# EasyEDA Pro project ProProject_ads1299+stm32f407第七版_2024-07-30.epro, board PCB
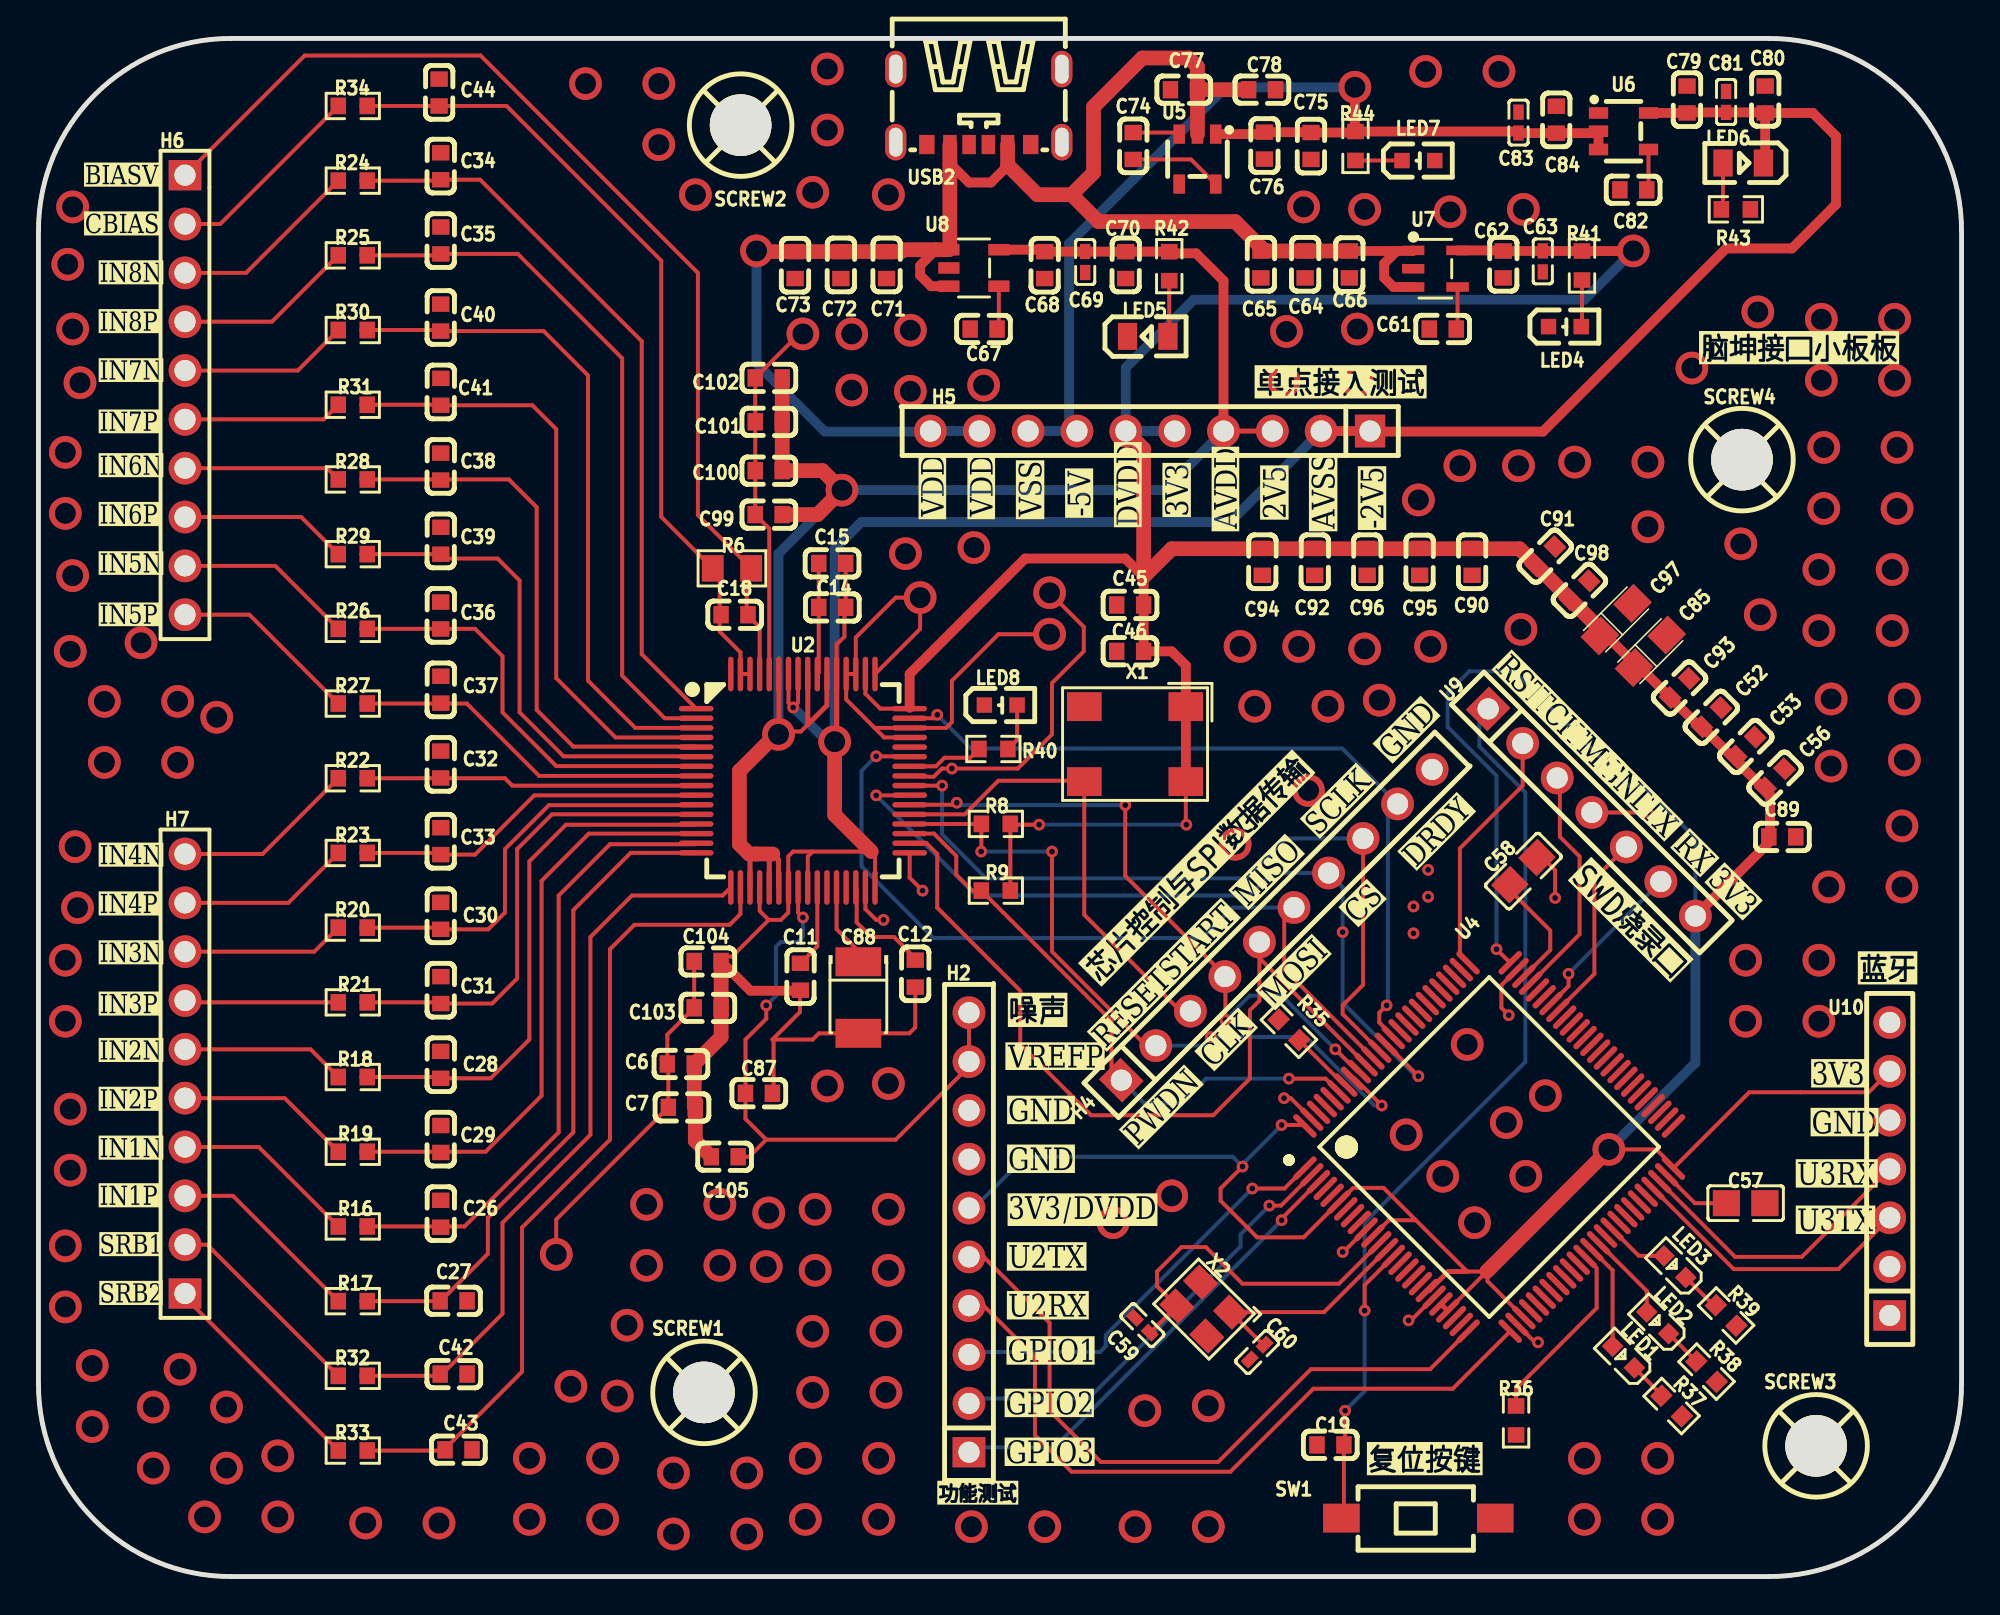
[diagram p3: board, top side]
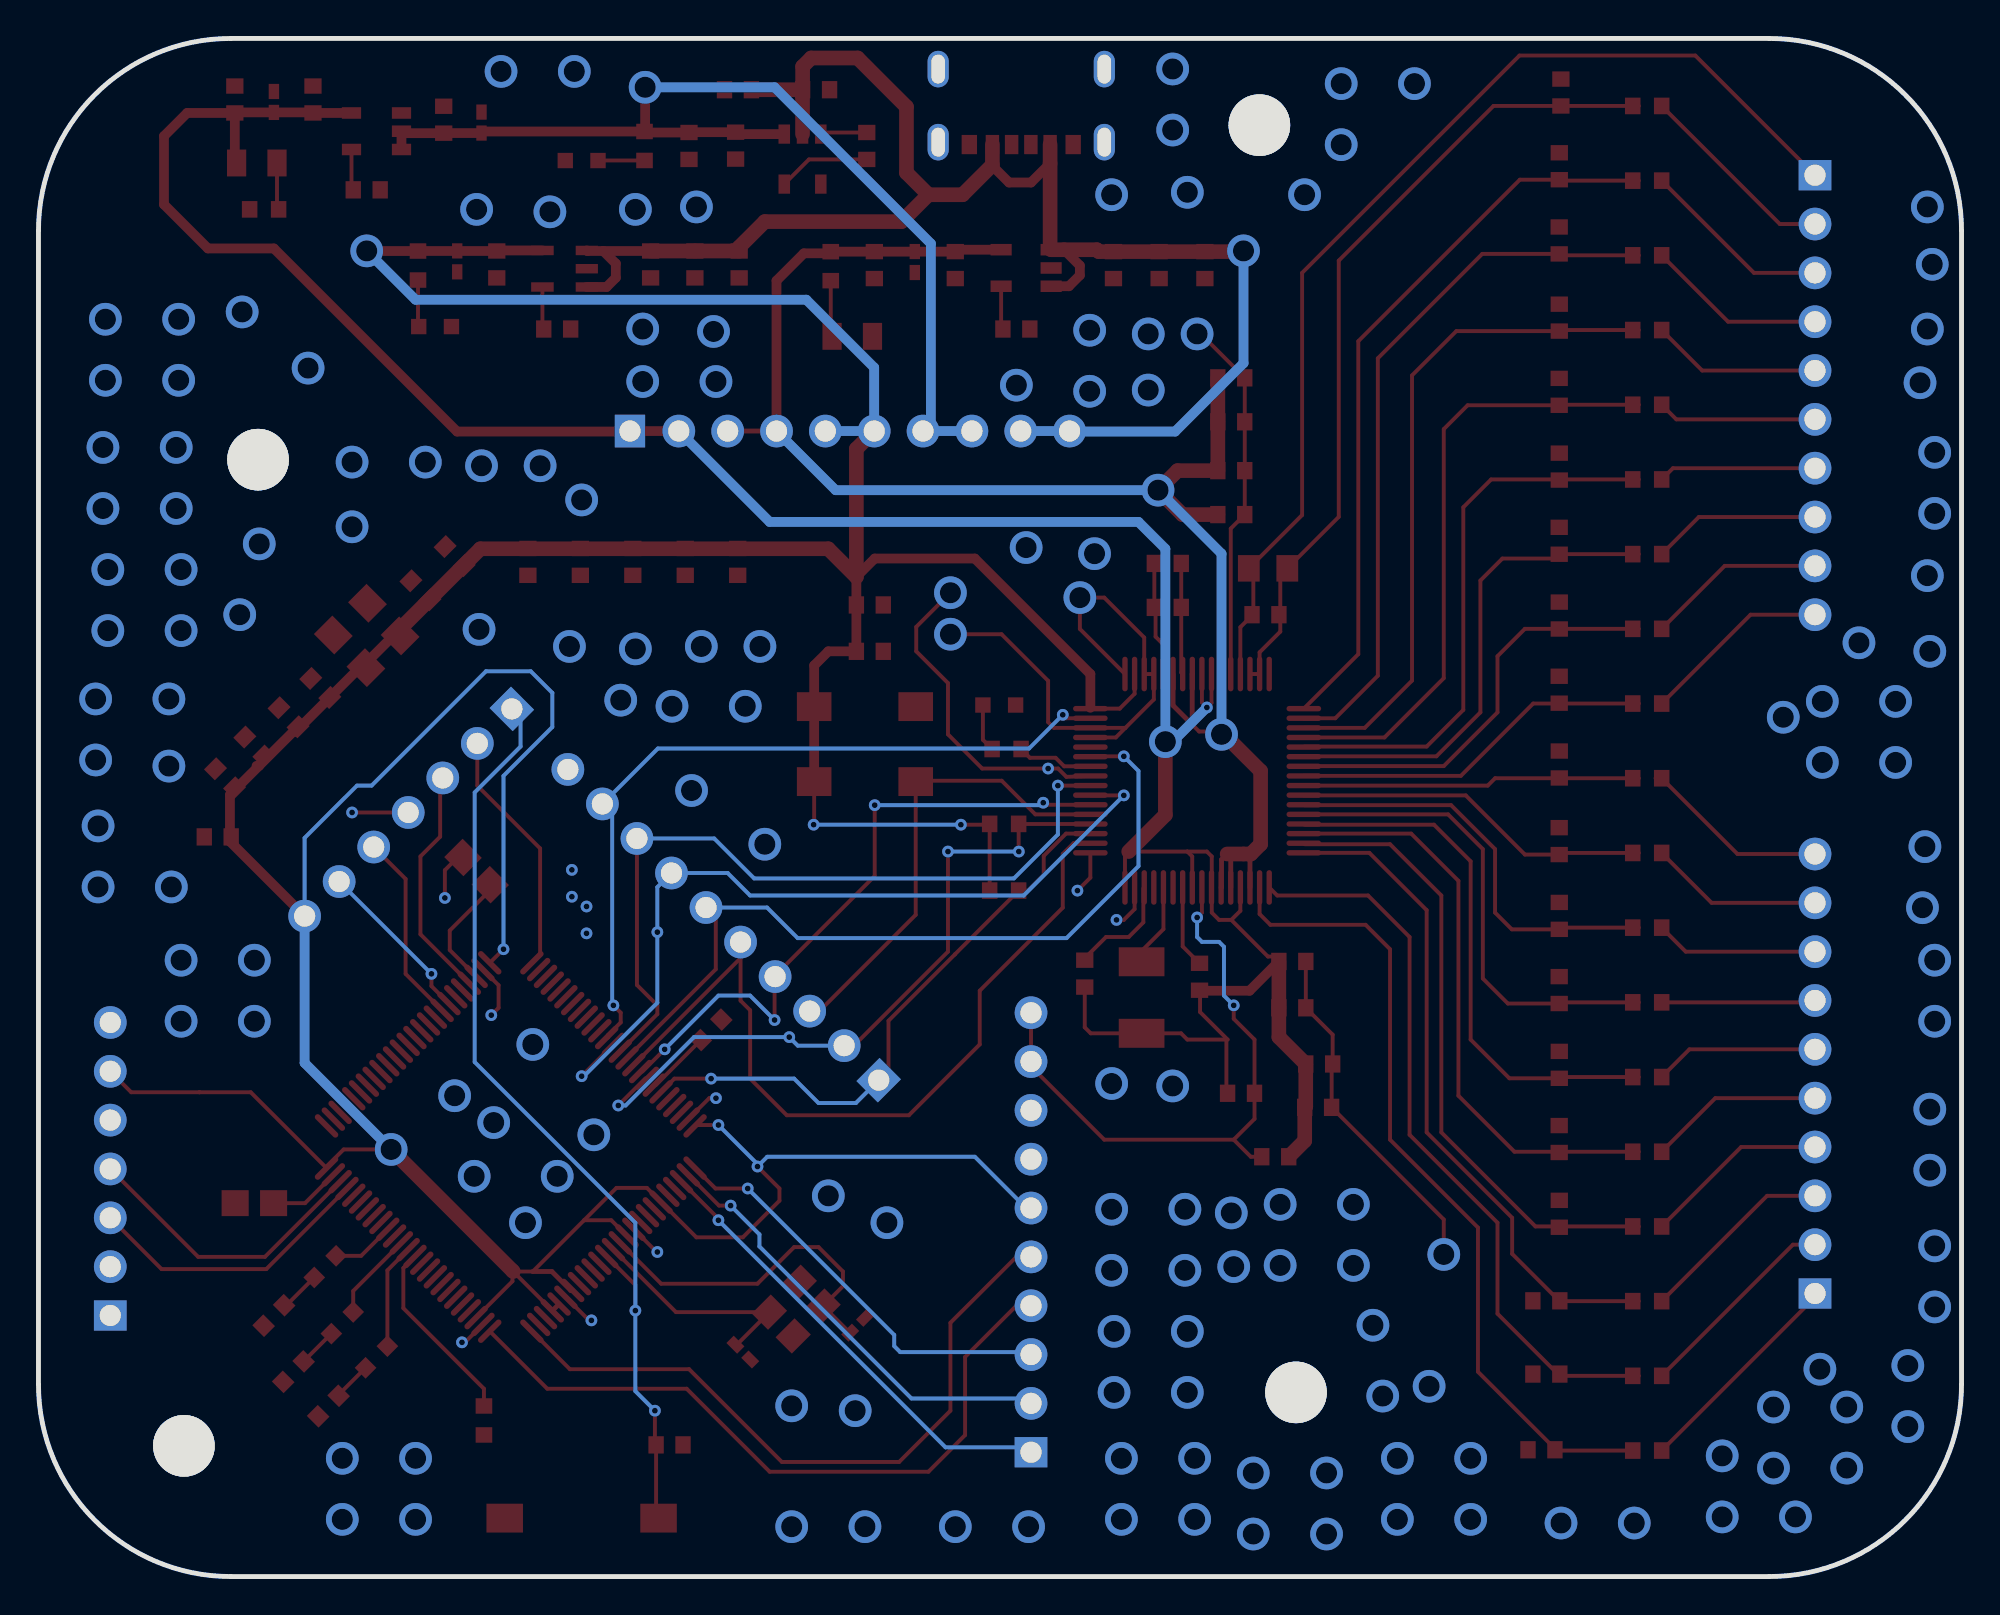
[diagram p4: board, bottom side, seen from below]

Outline 100 x 80 mm; copper layers: Top Layer, Bottom Layer. Coordinates in mm from the lower left corner of the outline.
Outline path: 0,70 0,10 arc(2.93,2.93) 10,0 90,0 arc(97.07,2.93) 100,10 100,70 arc(97.07,77.07) 90,80 10,80 arc(2.93,77.07) 0,70
Stack: Top Layer 0.035mm / Dielectric1 1.51mm FR4 er 4.5 / Bottom Layer 0.035mm

## Design rules (mm)
net GND: POWER
net DVDD: POWER
net VDD: POWER
net AVDD: POWER
net AVSS: POWER
net VSS: POWER
template: 自定义配置
spacing copperThickness1oz (default): track to track 0.102, other pairs 0.152 to 0.3
spacing copperThickness2oz: track to track 0.203, other pairs 0.152 to 0.3
track width copperThickness1oz (default): min 0.203, default 0.203, max 0.203
track width copperThickness2oz: min 0.203, default 0.254, max 2.54
track width power: min 0.203, default 0.254, max 5.08
differential pair differentialPair (default): width min 0.127, default 0.254, max 2.54; gap min 0.152, default 0.152
via viaSize (default): diameter min 0.61, default 0.61, max 10; hole min 0.305, default 0.305, max 6.299
net class POWER uses power
net GND uses power
net DVDD uses power
net VDD uses power
net AVDD uses power
net AVSS uses power
net VSS uses power

## Placement (name value [footprint] x y rotation side)
C6  1uF  [C0603]  33.4 26.66 180 top
C7  1uF  [C0603]  33.46 24.4 180 top
C11  1uF  [C0603]  39.62 31.2 270 top
C12  1uF  [C0603]  45.59 31.36 90 top
C14  100nF  [C0603]  41.28 50.41 180 top
C15  1uF  [C0603]  41.28 52.69 0 top
C18  1.5nF  [C0603]  36.19 50.03 180 top
C19  100nF  [C0603]  67.18 6.85 0 top
C26  4.7nF  [C0603]  20.92 18.87 270 top
C27  4.7nF  [C0603]  21.59 14.34 0 top
C28  4.7nF  [C0603]  20.92 26.61 270 top
C29  4.7nF  [C0603]  20.92 22.76 90 top
C30  4.7nF  [C0603]  20.92 34.36 270 top
C31  4.7nF  [C0603]  20.92 30.5 90 top
C32  4.7nF  [C0603]  20.92 42.24 270 top
C33  4.7nF  [C0603]  20.92 38.25 90 top
C34  4.7nF  [C0603]  20.92 73.35 270 top
C35  4.7nF  [C0603]  20.92 69.49 90 top
C36  4.7nF  [C0603]  20.92 49.98 270 top
C37  4.7nF  [C0603]  20.92 46.13 90 top
C38  4.7nF  [C0603]  20.92 57.73 270 top
C39  4.7nF  [C0603]  20.92 53.87 90 top
C40  4.7nF  [C0603]  20.92 65.48 270 top
C41  4.7nF  [C0603]  20.92 61.62 90 top
C42  4.7nF  [C0603]  21.59 10.53 180 top
C43  4.7nF  [C0603]  21.84 6.59 0 top
C44  4.7nF  [C0603]  20.83 77.19 270 top
C45  1uF  [C0603]  56.77 50.54 0 top
C46  100nF  [C0603]  56.77 48.12 0 top
C52  100nF  [C0603]  87 44.69 45 top
C53  100nF  [C0603]  88.77 43.17 225 top
C56  100nF  [C0603]  90.3 41.52 225 top
C57  2.2uF  [C0805]  88.77 19.42 0 top
C58  2.2uF  [C0805]  77.22 36.69 45 top
C59  9pF  [C0402]  57.4 13.07 315 top
C60  9pF  [C0402]  63.37 11.67 45 top
C61  1uF  [C0603]  73.03 64.89 0 top
C62  10uF  [C0603]  76.17 68.25 270 top
C63  2.2uF  [C0402]  78.22 68.41 90 top
C64  10uF  [C0603]  65.87 68.25 270 top
C65  10uF  [C0603]  63.56 68.25 270 top
C66  1uF  [C0603]  68.17 68.25 90 top
C67  1uF  [C0603]  49.15 64.89 0 top
C68  1uF  [C0603]  52.33 68.21 90 top
C69  2.2uF  [C0402]  54.43 68.37 90 top
C70  10uF  [C0603]  56.53 68.21 270 top
C71  10uF  [C0603]  44.1 68.21 270 top
C72  10uF  [C0603]  41.72 68.21 270 top
C73  1uF  [C0603]  39.35 68.21 90 top
C74  1uF  [C0603]  56.93 74.41 270 top
C75  1uF  [C0603]  66.17 74.41 90 top
C76  10uF  [C0603]  63.75 74.42 270 top
C77  1uF  [C0603]  59.56 77.33 0 top
C78  10uF  [C0603]  63.63 77.33 0 top
C79  10uF  [C0603]  85.72 76.83 90 top
C80  1uF  [C0603]  89.79 76.83 270 top
C81  2.2uF  [C0402]  87.76 76.7 270 top
C82  10nF  [C0603]  82.93 72.13 0 top
C83  2.2uF  [C0402]  76.96 75.62 270 top
C84  10uF  [C0603]  78.93 75.77 90 top
C85  1uF  [CASE-A_3216]  83.82 48.12 45 top
C87  10uF  [C0603]  37.47 25.14 0 top
C88  100uF  [CASE-B_3528]  42.64 30.12 270 top
C89  4.7uF  [C0603]  90.68 38.47 180 top
C90  100nF  [C0603]  74.55 52.78 270 top
C91  100nF  [C0603]  78.36 53.08 45 top
C92  100nF  [C0603]  66.37 52.78 270 top
C93  100nF  [C0603]  85.34 46.22 45 top
C94  100nF  [C0603]  63.64 52.78 270 top
C95  1uF  [C0603]  71.82 52.78 90 top
C96  100nF  [C0603]  69.09 52.78 270 top
C97  1uF  [CASE-A_3216]  82.04 49.77 45 top
C98  100nF  [C0603]  80.14 51.3 45 top
C99  1uF  [C0603]  37.97 55.23 180 top
C100  1uF  [C0603]  37.97 57.52 180 top
C101  100nF  [C0603]  37.97 60.06 180 top
C102  100nF  [C0603]  37.97 62.35 180 top
C103  100nF  [C0603]  34.8 29.58 180 top
C104  100nF  [C0603]  34.8 31.99 180 top
C105  100nF  [C0603]  35.69 21.83 0 top
H2  PM254-1-10-Z-8.5  [HDR-TH_10P-P2.54-V-F]  48.39 17.9 90 top
H4  PM254-1-10-Z-8.5  [HDR-TH_10P-P2.54-V-F]  64.39 33.9 45 top
H5  PM254-1-10-Z-8.5  [HDR-TH_10P-P2.54-V-F]  57.81 59.58 180 top
H6  2.54-1*10P针  [HDR-TH_10P-P2.54-V-M-1]  7.62 61.46 270 top
H7  2.54-1*10P针  [HDR-TH_10P-P2.54-V-M-1]  7.62 26.15 90 top
LED1  KT-0603R  [LED0603-RD]  82.42 11.42 135 top
LED2  KT-0603R  [LED0603-RD]  84.2 13.2 135 top
LED3  KT-0603R  [LED0603-RD]  85.09 16.12 135 top
LED4  KT-0603W  [LED0603-R-RD_WHITE]  79.38 65.01 0 top
LED5  KT-0805G  [LED0805-R-RD]  57.68 64.51 0 top
LED6  KT-0805G  [LED0805-R-RD]  88.65 73.52 180 top
LED7  KT-0603W  [LED0603-R-RD_WHITE]  71.75 73.65 0 top
LED8  KT-0603W  [LED0603-R-RD_WHITE]  50.04 45.33 0 top
R6  1MΩ  [R0805]  36.06 52.44 180 top
R8  10kΩ  [R0603]  49.78 39.15 0 top
R9  10kΩ  [R0603]  49.78 35.68 0 top
R16  11kΩ  [R0603]  16.34 18.21 0 top
R17  11kΩ  [R0603]  16.34 14.32 0 top
R18  11kΩ  [R0603]  16.34 25.98 0 top
R19  11kΩ  [R0603]  16.34 22.09 0 top
R20  11kΩ  [R0603]  16.34 33.75 0 top
R21  11kΩ  [R0603]  16.34 29.87 0 top
R22  11kΩ  [R0603]  16.34 41.52 0 top
R23  11kΩ  [R0603]  16.34 37.64 0 top
R24  11kΩ  [R0603]  16.34 72.6 0 top
R25  11kΩ  [R0603]  16.34 68.72 0 top
R26  11kΩ  [R0603]  16.34 49.29 0 top
R27  11kΩ  [R0603]  16.34 45.41 0 top
R28  11kΩ  [R0603]  16.34 57.06 0 top
R29  11kΩ  [R0603]  16.34 53.18 0 top
R30  11kΩ  [R0603]  16.34 64.83 0 top
R31  11kΩ  [R0603]  16.34 60.95 0 top
R32  11kΩ  [R0603]  16.34 10.44 0 top
R33  11kΩ  [R0603]  16.34 6.55 0 top
R34  11kΩ  [R0603]  16.34 76.49 0 top
R35  10kΩ  [R0603]  65.02 28.44 135 top
R36  10kΩ  [R0603]  76.84 8.12 270 top
R37  100Ω  [R0603]  84.92 8.87 135 top
R38  100Ω  [R0603]  86.74 10.66 135 top
R39  100Ω  [R0603]  87.76 13.58 135 top
R40  270Ω  [R0603]  49.66 43.04 0 top
R41  10kΩ  [R0603]  80.26 68.19 90 top
R42  10kΩ  [R0603]  58.8 68.16 90 top
R43  10kΩ  [R0603]  88.26 71.11 180 top
R44  10kΩ  [R0603]  68.49 74.41 90 top
SCREW1  -  [M3螺丝]  34.67 9.51 0 top
SCREW2  -  [M3螺丝]  36.58 75.43 0 top
SCREW3  -  [M3螺丝]  92.5 6.74 0 top
SCREW4  -  [M3螺丝]  88.65 58.03 0 top
SW1  TS-1101-C-W  [SW-SMD_L6.0-W3.3-LS8.0]  71.75 3.04 0 top
U2  ADS1299IPAGR  [TQFP-64_L10.0-W10.0-P0.50-LS12.0-TL]  39.75 41.39 0 top
U4  STM32F407VGT6  [LQFP-100_L14.0-W14.0-P0.50-LS16.0-BL]  75.44 22.34 315 top
U5  TPS60403DBVR  [SOT-23-5_L3.0-W1.7-P0.95-LS2.8-BR]  60.27 73.72 90 top
U6  TPS72325DBVR  [SOT-23-5_L3.0-W1.7-P0.95-LS2.8-BR]  82.42 75.17 180 top
U7  TPS73233DBVR  [SOT-23-5_L3.0-W1.7-P0.95-LS2.8-BL]  72.64 68.02 270 top
U8  TPS73225DBVR  [SOT-23-5_L2.9-W1.6-P0.95-LS2.8-TL]  48.64 68.06 0 top
U9  PM254-1-07-Z-8.5  [HDR-TH_7P-P2.54-V-F]  80.77 39.74 315 top
U10  PM254-1-07-Z-8.5  [HDR-TH_7P-P2.54-V-F]  96.27 21.2 90 top
USB2  TYPE-C 6P(073)  [TYPE-C-SMD_TYPE-C-6P]  48.9 76.44 180 top
X1  2.048MHz  [OSC-SMD_4P-L7.0-W5.0-BL]  57.02 43.3 180 top
X2  16MHz  [OSC-SMD_4P-L3.2-W2.5-BL]  60.59 13.91 135 top

## Footprints (pads in the part's own frame, mm; a bottom-side part is the same pattern mirrored in y, then rotated)
C0402
  rect 0.79x0.54 smd: 1(-0.545,0) 2(0.545,0)
C0603
  rect 0.8x0.9 smd: 1(-0.7,0) 2(0.7,0)
C0805
  rect 1.41x1.35 smd: 1(-1,0) 2(1,0)
CASE-A_3216
  rect 1.5x1.359 smd: 1(-1.2,0) 2(1.2,0)
CASE-B_3528
  rect 1.506x2.376 smd: 1(-1.861,0) 2(1.861,0)
HDR-TH_7P-P2.54-V-F
  rect 1.575x1.7 hole 1.1: 1(-7.62,0)
  round 1.7 hole 1.1: 2(-5.08,0) 3(-2.54,0) 4(0,0) 5(2.54,0) 6(5.08,0) 7(7.62,0)
HDR-TH_10P-P2.54-V-F
  rect 1.575x1.7 hole 1.1: 1(-11.43,0)
  round 1.7 hole 1.1: 2(-8.89,0) 3(-6.35,0) 4(-3.81,0) 5(-1.27,0) 6(1.27,0) 7(3.81,0) 8(6.35,0) 9(8.89,0) 10(11.43,0)
HDR-TH_10P-P2.54-V-M-1
  rect 1.575x1.7 hole 1.1: 1(-11.43,0)
  round 1.7 hole 1.1: 2(-8.89,0) 3(-6.35,0) 4(-3.81,0) 5(-1.27,0) 6(1.27,0) 7(3.81,0) 8(6.35,0) 9(8.89,0) 10(11.43,0)
LED0603-R-RD_WHITE
  rect 0.8x0.8 smd: 1(0.851,0) 2(-0.851,0)
LED0603-RD
  rect 0.8x0.8 smd: 1(-0.799,-0.004) 2(0.799,0.004)
LED0805-R-RD
  rect 1x1.399 smd: 1(1.05,0) 2(-1.05,0)
LQFP-100_L14.0-W14.0-P0.50-LS16.0-BL
  oval 0.3x1.6 smd: 1(-6,-7.55) 2(-5.5,-7.55) 3(-5,-7.55) 4(-4.5,-7.55) 5(-4,-7.55) 6(-3.5,-7.55) 7(-3,-7.55) 8(-2.5,-7.55) 9(-2,-7.55) 10(-1.5,-7.55) 11(-1,-7.55) 12(-0.5,-7.55) 13(0,-7.55) 14(0.5,-7.55) 15(1,-7.55) 16(1.5,-7.55) 17(2,-7.55) 18(2.5,-7.55) 19(3,-7.55) 20(3.5,-7.55) 21(4,-7.55) 22(4.5,-7.55) 23(5,-7.55) 24(5.5,-7.55) 25(6,-7.55) 51(6,7.55) 52(5.5,7.55) 53(5,7.55) 54(4.5,7.55) 55(4,7.55) 56(3.5,7.55) 57(3,7.55) 58(2.5,7.55) 59(2,7.55) 60(1.5,7.55) 61(1,7.55) 62(0.5,7.55) 63(0,7.55) 64(-0.5,7.55) 65(-1,7.55) 66(-1.5,7.55) 67(-2,7.55) 68(-2.5,7.55) 69(-3,7.55) 70(-3.5,7.55) 71(-4,7.55) 72(-4.5,7.55) 73(-5,7.55) 74(-5.5,7.55) 75(-6,7.55)
  oval 1.6x0.3 smd: 26(7.55,-6) 27(7.55,-5.5) 28(7.55,-5) 29(7.55,-4.5) 30(7.55,-4) 31(7.55,-3.5) 32(7.55,-3) 33(7.55,-2.5) 34(7.55,-2) 35(7.55,-1.5) 36(7.55,-1) 37(7.55,-0.5) 38(7.55,0) 39(7.55,0.5) 40(7.55,1) 41(7.55,1.5) 42(7.55,2) 43(7.55,2.5) 44(7.55,3) 45(7.55,3.5) 46(7.55,4) 47(7.55,4.5) 48(7.55,5) 49(7.55,5.5) 50(7.55,6) 76(-7.55,6) 77(-7.55,5.5) 78(-7.55,5) 79(-7.55,4.5) 80(-7.55,4) 81(-7.55,3.5) 82(-7.55,3) 83(-7.55,2.5) 84(-7.55,2) 85(-7.55,1.5) 86(-7.55,1) 87(-7.55,0.5) 88(-7.55,0) 89(-7.55,-0.5) 90(-7.55,-1) 91(-7.55,-1.5) 92(-7.55,-2) 93(-7.55,-2.5) 94(-7.55,-3) 95(-7.55,-3.5) 96(-7.55,-4) 97(-7.55,-4.5) 98(-7.55,-5) 99(-7.55,-5.5) 100(-7.55,-6)
M3螺丝
  round 3.2 hole 3.2: 1(-0.064,0.064)
OSC-SMD_4P-L3.2-W2.5-BL
  rect 1.4x1.2 smd: 1(-1.1,-0.875) 2(1.1,-0.875) 3(1.1,0.875) 4(-1.1,0.875)
OSC-SMD_4P-L7.0-W5.0-BL
  rect 1.8x1.5 smd: 1(-2.64,-1.95) 2(2.64,-1.95) 3(2.64,1.95) 4(-2.64,1.95)
R0603
  rect 0.806x0.864 smd: 1(-0.753,0) 2(0.753,0)
R0805
  rect 1.133x1.377 smd: 1(-1,0) 2(1,0)
SOT-23-5_L2.9-W1.6-P0.95-LS2.8-TL
  rect 1.1x0.6 smd: 1(-1.3,0.95) 2(-1.3,0) 3(-1.3,-0.95) 4(1.3,-0.95) 5(1.3,0.95)
SOT-23-5_L3.0-W1.7-P0.95-LS2.8-BL
  rect 0.49x1.157 smd: 1(-0.95,-1.153) 2(0,-1.153) 3(0.95,-1.153)
  rect 0.49x1.175 smd: 4(0.95,1.153) 5(-0.95,1.153)
SOT-23-5_L3.0-W1.7-P0.95-LS2.8-BR
  rect 1x0.6 smd: 1(1.3,-0.95) 2(1.3,0) 3(1.3,0.95) 4(-1.3,0.95) 5(-1.3,-0.95)
SW-SMD_L6.0-W3.3-LS8.0
  rect 1.9x1.5 smd: 1(-4,0) 2(4,0)
TQFP-64_L10.0-W10.0-P0.50-LS12.0-TL
  oval 1.8x0.28 smd: 1(-5.55,3.75) 2(-5.55,3.25) 3(-5.55,2.75) 4(-5.55,2.25) 5(-5.55,1.75) 6(-5.55,1.25) 7(-5.55,0.75) 8(-5.55,0.25) 9(-5.55,-0.25) 10(-5.55,-0.75) 11(-5.55,-1.25) 12(-5.55,-1.75) 13(-5.55,-2.25) 14(-5.55,-2.75) 15(-5.55,-3.25) 16(-5.55,-3.75) 33(5.55,-3.75) 34(5.55,-3.25) 35(5.55,-2.75) 36(5.55,-2.25) 37(5.55,-1.75) 38(5.55,-1.25) 39(5.55,-0.75) 40(5.55,-0.25) 41(5.55,0.25) 42(5.55,0.75) 43(5.55,1.25) 44(5.55,1.75) 45(5.55,2.25) 46(5.55,2.75) 47(5.55,3.25) 48(5.55,3.75)
  oval 0.28x1.8 smd: 17(-3.75,-5.55) 18(-3.25,-5.55) 19(-2.75,-5.55) 20(-2.25,-5.55) 21(-1.75,-5.55) 22(-1.25,-5.55) 23(-0.75,-5.55) 24(-0.25,-5.55) 25(0.25,-5.55) 26(0.75,-5.55) 27(1.25,-5.55) 28(1.75,-5.55) 29(2.25,-5.55) 30(2.75,-5.55) 31(3.25,-5.55) 32(3.75,-5.55) 49(3.75,5.55) 50(3.25,5.55) 51(2.75,5.55) 52(2.25,5.55) 53(1.75,5.55) 54(1.25,5.55) 55(0.75,5.55) 56(0.25,5.55) 57(-0.25,5.55) 58(-0.75,5.55) 59(-1.25,5.55) 60(-1.75,5.55) 61(-2.25,5.55) 62(-2.75,5.55) 63(-3.25,5.55) 64(-3.75,5.55)
TYPE-C-SMD_TYPE-C-6P
  oval 1.1x1.9 hole 0.7x1.5: 7(-4.32,1.837) 7(-4.32,-1.962) 7(4.32,1.837) 7(4.32,-1.962)
  rect 0.7x1 smd: A5(-0.5,1.962) A9(1.5,1.962) B5(0.5,1.962) B9(-1.5,1.962)
  rect 0.8x1 smd: A12(2.7,1.962) B12(-2.7,1.962)

## Nets
As in the schematic.

Pads without a net: SCREW1 1; SCREW2 1; SCREW3 1; SCREW4 1; U2 27 29 44 64; U4 4 5 7 8 9 15 16 17 18 23 24 29 30 31 32 33 34 35 36 40 42 43 44 45 46 51 52 53 54 55 56 57 58 59 60 61 62 63 64 65 66 67 70 71 77 78 79 80 81 82 83 84 85 86 96 97 98; U10 2 7; USB2 7 A5 B5

## Via types
v1: diameter 1.7, hole 1.1, Top Layer to Bottom Layer, 164 vias
v2: diameter 0.61, hole 0.305, Top Layer to Bottom Layer, 44 vias

## Routing (per net, layer and track width the routed paths; a pad name or vN(x,y) marks a point on that pad's centre or on a via; arc(x,y) is an arc through that point)
AVDD: length 94.4
  Top Layer w0.203: 40,44.31 39.64,43.95 38.5,43.95
  Top Layer w0.254: U2.22 38.48,35.86 38.48,37.29 38.19,37.58 38,37.39 U2.21 ; U2.59 38.5,43.95 ; U2.54 41,45.31 40,44.31 40,46.94 U2.56 ; 54.43,68.91 C69.2 ; H5.4 H5.3 ; U2.19 37,37.25 37.34,37.58
  Top Layer w0.508: U8.5 52.23,69.01 C68.2 C70.1 58.8,68.91 R42.2 58.89,68.82 60.2,68.82 61.62,67.4 H5.4
  Top Layer w0.762: C102.1 C101.1 C100.1 40.77,57.52 v1(41.78,56.5) 40.51,55.23 C99.1 ; 38.19,37.58 36.96,37.58 36.45,38.09 36.45,41.9 38.5,43.95
  Bottom Layer w0.508: v1(38.48,43.81) 38.48,53.2 v1(41.78,56.5) 58.55,56.5 H5.4
AVSS: length 157.5
  Top Layer w0.203: C14.1 C15.2 ; U2.57 39.5,45.46 v2(39.24,45.2) 39,45.44 U2.58 ; 38.23,27.87 38.23,25.2 C87.2 ; 40.26,37.71 43.31,37.71 43.5,37.52 U2.32 ; 40.26,37.71 39.24,37.71 38.99,37.45 38.99,35.85 U2.23 38.99,35.83 38.99,34.53 38.61,34.15 37.97,34.15 ; 40.26,37.71 40,37.45 40,35.84 U2.25 ; 37.97,34.15 36.07,32.25 35.62,32.25 ; 37.97,34.15 37.5,34.62 U2.20 ; 41.91,50.34 41.91,48.89 41.5,48.48 U2.53 ; C11.2 39.6,30.47 39.6,29.36 38.16,27.93 40.26,27.93 40.58,28.25 45.28,28.25 45.59,28.56 45.59,30.66
  Top Layer w0.254: 41.4,43.3 41.5,43.4 U2.53
  Top Layer w0.508: C80.2 89.76,76.15 C81.2 85.75,76.15 C79.1 U6.5 ; C80.2 92.27,76.12 93.47,74.92 93.47,71.36 91.19,69.08 87.76,69.08 78.23,59.55 69.27,59.55 H5.1 H5.2 ; C80.2 89.79,73.62 LED6.2 ; C104.1 37.02,30.47 39.6,30.47
  Top Layer w0.762: 41.4,43.3 41.4,39.61 43.31,37.71 ; C104.1 C103.1 35.5,28.06 C6.1 34.1,24.46 C7.1 34.16,22.67 C105.1
  Bottom Layer w0.508: H5.2 61.98,54.85 42.8,54.85 41.4,53.46 v1(41.4,43.42) 41.02,43.42 v2(39.24,45.2)
DVDD: length 273
  Top Layer w0.203: 71.63,18.53 69.94,20.22 68.36,20.22 U4.6 65.79,17.64 63.37,17.64 61.47,19.55 61.47,20.18 v2(62.61,21.33) ; 71.63,18.53 70.21,18.53 U4.11 ; 71.63,18.53 74.29,15.87 75.31,15.87 73.28,13.84 U4.22 ; 75.35,15.91 75.35,15.36 77.24,13.47 ; U2.50 43,45.92 43.77,45.14 45.3,45.14 ; v2(52.03,39.11) 50.58,39.11 ; 91.63,25.19 91.63,25.19 ; 91.63,25.19 95.18,25.19 U10.6 ; 91.63,25.19 88.96,25.19 85.06,21.29 ; v1(81.66,22.22) 84.13,22.22 85.06,21.29 ; v2(64.64,23.48) 65.81,23.48 U4.100 ; U4.75 76.53,31.92 v2(75.82,32.63) ; U4.50 85.06,21.29 ; R8.2 R9.2 ; 59.66,41.35 59.66,39.13
  Top Layer w0.254: U4.19 72.32,14.88 73.3,15.87 74.29,15.87 ; 72.93,14.18 U4.22
  Top Layer w0.508: U9.7 90.04,38.24 90.04,40.66 88.53,42.17 ; 81.26,49.21 83.24,47.24 83.33,47.24 86.63,43.94 86.75,43.94 88.53,42.17 ; 57.47,50.41 C46.2 58.93,48.12 59.66,47.39 59.66,41.35 ; 78.22,68.95 80.26,68.95 R41.2 82.92,68.94 v1(82.93,68.95) ; 78.22,68.95 C63.2 ; 78.22,68.95 C62.1 76.14,68.97 U7.5 ; 88.53,42.17 88.66,42.17 ; C45.2 57.47,52 56.51,52.95 51.31,52.95 45.3,46.94 45.3,45.19
  Top Layer w0.762: 81.26,49.21 77.02,53.46 58.93,53.46 57.47,52 57.47,58.65 H5.6 ; 75.31,15.87 v1(81.66,22.22)
  Bottom Layer w0.203: 48.9,19.42 51.31,21.83 62.1,21.83 v2(62.61,21.33) 62.61,21.45 v2(64.64,23.48) ; v2(75.82,32.63) 75.82,41.65 73.28,44.19 73.28,45.96 74.4,47.09 76.73,47.09 82.68,41.14 83.44,41.14 86.16,38.42 U9.7 ; v2(59.69,39.11) v2(52.03,39.11)
  Bottom Layer w0.508: v1(81.66,22.22) 86.16,26.71 U9.7 ; H5.5 H5.6 56.54,62.88 60.07,66.41 80.39,66.41 v1(82.93,68.95)
GND: length 103.7
  Top Layer w0.203: v2(78.87,35.3) 78.87,36.74 78.06,37.54 ; v1(26.92,16.75) 26.92,18.57 C7.2 32.75,26.61 32.7,26.66 32.7,28.18 C103.2 C104.2 ; U4.27 77.82,12.18 v2(77.98,12.18) ; 45.3,41.64 46.55,41.59 46.98,42.03 v2(47.5,42.03) 50.93,42.03 52.71,43.81 52.71,46.47 54.36,48.12 54.36,49.39 v1(52.58,51.17) ; v1(52.58,49.01) 49.92,49.01 47.5,46.59 47.5,44.44 47.2,44.14 43.48,44.14 ; 45.3,37.64 45.3,36.35 v2(45.97,35.68) ; 43.48,44.14 42,45.62 U2.52 U2.51 42.5,48.84 44.58,50.92 v1(45.85,50.92) 45.85,49.29 U2.49 ; 43.48,44.14 43.98,43.64 45.3,43.64 ; U4.20 71.37,13.32 v2(71.25,13.32) ; U4.74 76.07,30.76 76.07,29.58 v2(76.45,29.2) ; v2(67.82,16.88) 67.86,16.88 U4.10 ; U2.31 43,34.71 43.56,34.15 v2(43.94,34.15) ; v1(39.75,64.63) 39.56,64.63 37.27,62.35 37.27,55.23 38,54.51 U2.60 ; U4.99 65.12,24.88 v2(64.77,24.88) ; v2(83.69,39.74) U9.4
  vias: v1(1.4,58.47) v1(1.4,55.3) v1(1.4,32.06) v1(1.4,28.88) v1(1.4,17.2) v1(1.4,14.02) v1(1.52,68.25) v1(1.65,48.12) v1(1.65,24.31) v1(1.65,21.14) v1(1.78,71.24) v1(1.78,64.89) v1(1.78,52.06) v1(1.91,37.96) v1(2.03,34.79) v1(2.16,62.09) v1(2.79,10.98) v1(2.79,7.8) v1(3.43,45.52) v1(3.43,42.34) v1(5.33,48.57) v1(5.97,8.82) v1(5.97,5.64) v1(7.24,45.52) v1(7.24,42.34) v1(7.37,10.78) v1(8.64,3.1) v1(9.27,44.69) v1(9.78,8.82) v1(9.78,5.64) v1(12.45,6.28) v1(12.45,3.1) v1(17.02,2.78) v1(20.83,2.78) v1(25.53,6.15) v1(25.53,2.97) v1(27.69,9.9) v1(28.45,77.65) v1(29.34,6.15) v1(29.34,2.97) v1(30.1,9.39) v1(30.61,13.07) v1(31.62,19.36) v1(31.62,16.18) v1(32.26,77.65) v1(32.26,74.48) v1(33.02,5.39) v1(33.02,2.21) v1(34.16,71.87) v1(35.43,19.36) v1(35.43,16.18) v1(36.83,5.39) v1(36.83,2.21) v1(37.85,16.12) v1(37.97,18.91) v1(39.88,6.15) v1(39.88,2.97) v1(40.26,72) v1(40.26,12.75) v1(40.26,9.58) v1(40.39,19.1) v1(40.39,15.93) v1(41.02,78.41) v1(41.02,75.24) v1(41.02,25.52) v1(42.29,64.63) v1(42.29,61.71) v1(43.69,6.15) v1(43.69,2.97) v1(44.07,12.75) v1(44.07,9.58) v1(44.2,71.87) v1(44.2,25.64) v1(44.2,19.1) v1(44.2,15.93) v1(45.09,53.2) v1(45.34,64.82) v1(45.34,61.65) v1(48.51,2.59) v1(48.64,53.52) v1(49.15,61.97) v1(52.32,2.59) v1(55.88,18.41) v1(57.02,2.59) v1(57.53,8.63) v1(58.93,19.8) v1(60.83,8.88) v1(60.83,2.59) v1(62.23,38.09) v1(62.48,48.38) v1(63.25,45.27) v1(64.77,62.16) v1(64.9,64.76) v1(65.53,48.38) v1(65.79,71.24) v1(66.04,40.88) v1(67.06,45.27) v1(68.58,64.89) v1(68.58,62.16) v1(68.96,71.11) v1(68.96,48.25) v1(69.72,45.58) v1(71.12,22.98) v1(71.75,56) v1(72.14,78.29) v1(72.39,48.38) v1(73.03,20.82) v1(73.41,70.98) v1(73.91,57.78) v1(74.29,27.68) v1(74.68,18.41) v1(75.95,78.29) v1(76.33,23.61) v1(76.96,57.78) v1(77.09,49.27) v1(77.22,71.11) v1(77.34,20.82) v1(78.36,25.01) v1(79.88,57.97) v1(80.39,6.15) v1(80.39,2.97) v1(83.69,57.97) v1(83.69,54.6) v1(84.2,6.15) v1(84.2,2.97) v1(85.98,62.86) v1(88.52,53.71) v1(88.77,32.06) v1(88.77,28.88) v1(89.41,65.78) v1(89.53,50.03) v1(92.58,52.38) v1(92.58,49.2) v1(92.58,32.06) v1(92.58,28.88) v1(92.71,65.39) v1(92.71,62.22) v1(92.84,58.73) v1(92.84,55.55) v1(93.09,35.87) v1(93.22,45.65) v1(93.22,42.15) v1(96.39,52.38) v1(96.39,49.2) v1(96.52,65.39) v1(96.52,62.22) v1(96.65,58.73) v1(96.65,55.55) v1(96.9,39.04) v1(96.9,35.87) v1(97.03,45.65) v1(97.03,42.47) v2(71.5,34.85) v2(71.5,33.45) v2(72.26,36.76) v2(72.26,35.36)
VDD: length 87
  Top Layer w0.508: 70.63,68.95 71.46,68.95 U7.1 ; 70.63,68.95 C66.2 ; 70.63,68.95 69.98,68.29 69.98,67.55 70.46,67.07 U7.3 ; 47.4,73.5 48.39,72.51 49.53,72.51 50.4,73.37 50.4,73.42 ; 46.67,69.01 45.85,68.19 45.85,67.68 46.42,67.11 U8.3
  Top Layer w0.762: v1(37.34,68.95) 37.38,68.91 C73.2 C72.1 C71.1 44.86,68.91 44.96,69.01 U8.1 47.4,69.07 USB2.A9 ; USB2.B9 50.4,73.42 51.94,71.87 53.72,71.87 ; 53.72,71.87 55.12,70.47 62.23,70.47 63.56,69.14 C65.1 C64.1 C66.2 ; 53.72,71.87 54.86,73.02 54.86,76.44 57.4,78.98 59.82,78.98 60.26,78.54 60.26,77.33 ; 60.26,77.33 C78.1 ; 60.26,77.33 60.27,77.33 U5.2
  Bottom Layer w0.508: H5.9 H5.10 46.35,59.55 40.89,59.55 37.34,63.11 v1(37.34,68.95)
VSS: length 54
  Top Layer w0.508: 68.45,75.13 68.43,75.11 C75.2 66.15,75.12 C76.1 63.65,75.02 U5.1 ; 68.45,75.13 R44.2 76.88,75.16 C83.2 78.92,75.08 C84.1 81.02,75.07 U6.2 U6.3 ; 68.45,75.13 v1(68.45,77.46)
  Bottom Layer w0.508: v1(68.45,77.46) 61.72,77.46 53.59,69.33 53.59,59.99 H5.7 H5.8
BIAS_INV: length 56.3
  Top Layer w0.203: U2.61 37.5,49.38 36.82,50.05 36.82,52.2 R6.1 34.29,55.21 34.29,67.81 22.99,79.11 13.84,79.11 H6.1
BIAS_OUT: length 42.6
  Top Layer w0.203: 16.78,76.49 24.34,76.49 32.38,68.44 32.38,55.11 R6.2 35.43,52.08 35.43,49.15 36.5,48.07 U2.63 U2.62
CBIAS: length 10.5
  Top Layer w0.203: H6.2 9.45,70.35 R34.1
CIN1N: length 9.7
  Top Layer w0.203: H7.4 11.46,22.34 R16.1
CIN1P: length 10.2
  Top Layer w0.203: H7.3 10.11,19.8 R17.1
CIN2N: length 8.6
  Top Layer w0.203: H7.6 14.15,27.42 R18.1
CIN2P: length 9.1
  Top Layer w0.203: R19.1 12.8,24.88 H7.5
CIN3N: length 8.5
  Top Layer w0.203: H7.8 14.34,32.5 R20.1
CIN3P: length 8
  Top Layer w0.203: R21.1 7.72,29.87 H7.7
CIN4N: length 9.6
  Top Layer w0.203: 15.91,41.52 15.91,41.52 ; R22.1 11.65,37.58 H7.10
CIN4P: length 9
  Top Layer w0.203: H7.9 13,35.04 R23.1
CIN5N: length 9.3
  Top Layer w0.203: H6.9 12.32,52.57 R26.1
CIN5P: length 9.9
  Top Layer w0.203: R27.1 10.97,50.03 H6.10
CIN6N: length 8.2
  Top Layer w0.203: R28.1 15.01,57.65 H6.7
CIN6P: length 8.8
  Top Layer w0.203: R29.1 13.66,55.11 H6.8
CIN7N: length 8.8
  Top Layer w0.203: R30.1 13.48,62.73 H6.5
CIN7P: length 8.3
  Top Layer w0.203: H6.6 14.83,60.19 R31.1
CIN8N: length 10
  Top Layer w0.203: H6.3 10.79,67.81 R24.1
CIN8P: length 9.4
  Top Layer w0.203: R25.1 12.14,65.27 H6.4
CLK: length 24.3
  Top Layer w0.203: X1.3 54.38,34.42 59.39,29.41 59.9,29.41 ; 45.3,39.64 48.16,39.64 49.91,41.39 54.34,41.39
CS: length 42.8
  Top Layer w0.203: v2(71.75,26.03) U4.88 ; v2(43.56,40.63) 45.29,40.63
  Bottom Layer w0.203: v2(43.56,40.63) 48.77,35.42 62.99,35.42 64.16,36.59 67.08,36.59 67.82,35.86 v2(67.82,33.52) 67.82,29.84 71.64,26.03 v2(71.75,26.03)
CSRB1: length 10.8
  Top Layer w0.203: H7.2 8.77,17.26 R32.1
CSRB2: length 11.5
  Top Layer w0.203: H7.1 7.62,14.52 R33.1
DRDY: length 40.2
  Top Layer w0.203: 70.38,28.03 70.38,28.16 69.72,28.82 69.72,29.33 v2(70.1,29.71) ; 45.3,44.64 46.56,44.64 v2(46.74,44.82)
  Bottom Layer w0.203: v2(46.74,44.82) 48.49,43.07 67.79,43.07 70.68,40.19 70.17,39.68 70.17,29.77 v2(70.1,29.71)
IN1N: length 32.8
  Top Layer w0.203: 16.78,18.21 22.16,18.21 27.05,23.1 27.05,35.42 29.72,38.09 34.15,38.09
IN1P: length 35
  Top Layer w0.203: 16.78,14.32 20.91,14.32 23.37,16.79 23.37,18.66 27.81,23.1 27.81,34.66 30.79,37.64 U2.16
IN2N: length 28.2
  Top Layer w0.203: 34.16,39.11 27.43,39.11 25.53,37.2 25.53,27.93 23.51,25.92 20.92,25.92 ; 16.78,25.98 20.85,25.98
IN2P: length 30.8
  Top Layer w0.203: 16.78,22.09 23.25,22.09 26.16,25.01 26.16,36.19 28.62,38.64 U2.14
IN3N: length 21.9
  Top Layer w0.203: C30.2 23.39,33.66 24.26,34.53 24.26,37.84 26.54,40.12 34.18,40.12 ; 16.78,33.75 20.83,33.75
IN3P: length 25.4
  Top Layer w0.203: U2.12 26.7,39.64 24.89,37.84 24.89,31.11 23.59,29.8 C31.1 ; 16.78,29.87 20.86,29.87
IN4N: length 17.6
  Top Layer w0.203: 34.2,41.14 24.64,41.14 24.25,41.52 16.78,41.52
IN4P: length 18.6
  Top Layer w0.203: 34.19,40.63 25.78,40.63 22.7,37.55 C33.1 ; 16.78,37.64 20.84,37.64
IN5N: length 22.1
  Top Layer w0.203: 34.19,42.15 26.92,42.15 24.13,44.95 24.13,47.87 22.71,49.29 16.78,49.29
IN5P: length 19
  Top Layer w0.203: 16.78,45.41 22.27,45.41 26.03,41.65 34.2,41.65
IN6N: length 29.3
  Top Layer w0.203: 34.17,43.17 27.81,43.17 25.91,45.08 25.91,55.62 24.46,57.06 16.78,57.06
IN6P: length 25.8
  Top Layer w0.203: 34.18,42.66 27.31,42.66 25.02,44.95 25.02,51.81 23.88,52.95 21.15,52.95 20.92,53.18 16.78,53.18
IN7N: length 35.2
  Top Layer w0.203: U2.3 31.03,44.14 28.57,46.6 28.57,62.47 26.27,64.78 C40.2 ; 16.78,64.83 20.86,64.83
IN7P: length 32.1
  Top Layer w0.203: U2.4 30.01,43.64 26.92,46.73 26.92,59.68 25.68,60.92 C41.1 ; 16.78,60.95 20.89,60.95
IN8N: length 38.3
  Top Layer w0.203: U2.1 31.37,47.97 31.37,64.25 22.97,72.65 C34.2 ; 16.78,72.6 20.87,72.6
IN8P: length 37
  Top Layer w0.203: 16.78,68.72 20.85,68.72 ; U2.2 32.56,44.64 30.35,46.85 30.35,63.36 24.92,68.79 C35.1
IO1: length 21.3
  Top Layer w0.203: v2(63.12,20.18) 64.79,20.18 U4.1
  Bottom Layer w0.203: 48.9,11.8 49.02,11.67 55.19,11.67 55.5,11.99 55.5,12.56 v2(63.12,20.18)
IO2: length 22.5
  Top Layer w0.203: U4.2 64.61,19.29 v2(64.01,19.29)
  Bottom Layer w0.203: v2(64.01,19.29) 62.51,17.8 62.51,17.17 54.6,9.26 48.9,9.26
IO3: length 23.4
  Top Layer w0.203: v2(64.64,18.53) 64.64,18.62 U4.3
  Bottom Layer w0.203: v2(64.64,18.53) 52.83,6.72 48.9,6.72
JTCK/SWCLK: length 12.9
  Top Layer w0.203: U4.76 73.91,32.35 73.91,37.87 77.18,41.14 77.18,43.33
JTMS/SWDIO: length 11.9
  Top Layer w0.203: 79.11,41.27 79.11,38.48 80.14,37.45 80.14,33.41 U4.72
MISO: length 42.4
  Top Layer w0.203: 65.29,34.8 64.78,34.29 64.78,31.59 U4.90 ; v2(43.56,42.66) 45.28,42.66
  Bottom Layer w0.203: 65.29,34.8 62.11,34.8 60.52,33.2 46.54,33.2 42.8,36.95 42.8,41.9 v2(43.56,42.66)
MOSI: length 42.8
  Top Layer w0.203: 45.3,38.14 46.18,38.14 46.74,37.58 46.74,34.79 51.05,30.47 51.05,27.68 54.74,23.99 61.09,23.99 62.99,25.9 62.99,29.45 63.49,29.95 63.49,32.17 ; 63.49,33 63.49,32.17 ; 63.49,32.17 U4.91
NRST: length 50.6
  Top Layer w0.203: U4.14 68.96,15.16 v2(68.96,13.83) ; 67.88,6.85 67.88,3.17 SW1.1 ; v2(67.94,8.63) 67.94,6.91
  Bottom Layer w0.203: v2(67.94,8.63) 68.96,9.64 v2(68.96,13.83) 68.96,18.41 77.32,26.76 77.32,40.78 74.93,43.17 74.93,44.68 75.38,45.13
PWDN: length 31
  Top Layer w0.203: U4.95 66.93,25.9 v2(65.02,25.9) ; 45.3,38.64 46.56,38.64 47.73,37.48 47.73,36.5 48.55,35.68 R9.1 52.35,32.36 52.35,32.36 55.8,28.91 55.8,26.33 56.31,25.82
  Bottom Layer w0.203: v2(65.02,25.9) 60.71,25.9 59.44,24.63 57.5,24.63 56.31,25.82
RESET: length 37.4
  Top Layer w0.203: v2(69.85,24.5) 68.44,25.91 ; v2(49.02,37.71) 49.03,37.72 R8.1 49.02,39.14 45.3,39.14 ; 58.1,27.61 57.59,27.61 52.71,32.5 v2(52.71,37.71)
  Bottom Layer w0.203: v2(49.02,37.71) v2(52.71,37.71) ; 57.59,27.61 60.52,27.61 v2(60.96,28.06) 65.91,28.06 69.47,24.5 v2(69.85,24.5)
SCLK: length 40.2
  Top Layer w0.203: 68.88,38.39 68.88,30.77 67.82,29.71 67.82,29.25 U4.89 ; v2(46.99,41.14) 45.31,41.14
  Bottom Layer w0.203: 68.88,38.39 64.86,38.39 62.78,36.31 49.28,36.31 46.99,38.6 v2(46.99,41.14)
SRB1: length 38.5
  Top Layer w0.203: U2.17 35.58,35.42 30.86,35.42 28.7,33.26 28.7,22.98 24.13,18.41 24.13,13.67 20.9,10.44 16.78,10.44
SRB2: length 42.6
  Top Layer w0.203: R33.2 21.1,6.55 C43.1 21.14,6.65 25.15,10.65 25.15,18.15 29.72,22.72 29.72,32.63 30.99,33.9 35.94,33.9 36.5,34.46 U2.18
START: length 33.7
  Top Layer w0.203: v2(47.75,40.25) 47.65,40.14 45.3,40.14 ; v2(56.51,40.12) 56.51,36.44 61.72,31.23 61.72,31.18 ; 61.72,31.18 v2(61.72,28.95) ; 61.72,31.18 61.69,31.2 ; v2(67.44,27.42) 68.59,26.27
  Bottom Layer w0.203: v2(56.51,40.12) 47.88,40.12 v2(47.75,40.25) ; v2(61.72,28.95) 62.99,30.22 64.64,30.22 v2(67.44,27.42)
USART1/RX: length 8.7
  Top Layer w0.203: U4.69 79.56,30.71 v2(79.56,31.35)
  Bottom Layer w0.203: v2(79.56,31.35) 84.36,36.15
USART1/TX: length 10
  Top Layer w0.203: U9.5 80.91,36.28 80.91,31.35 U4.68
USART2/RX: length 37.1
  Top Layer w0.203: H2.4 49.15,14.09 51.82,11.42 51.82,7.36 53.72,5.45 61.98,5.45 66.29,9.77 73.54,9.77 U4.26
USART2/TX: length 35.9
  Top Layer w0.203: U4.25 72.37,10.78 66.17,10.78 61.34,5.96 55.25,5.96 52.58,8.63 52.58,13.2 49.15,16.63 48.39,16.63
USART3/RX: length 15.5
  Top Layer w0.203: U10.4 91.69,16.63 88.22,16.63 U4.48
USART3/TX: length 15.1
  Top Layer w0.203: U4.47 88.15,15.99 93.6,15.99 U10.3
VREFP: length 32.6
  Top Layer w0.203: 48.9,29.58 48.39,29.07 48.39,26.53 44.58,22.72 37.85,22.72 ; v2(37.85,29.71) 37.85,29.01 36.76,27.93 36.76,23.8 37.85,22.72 ; U2.24 39.5,34.53 v2(39.75,34.28) ; 37.85,22.72 36.96,21.83 C105.2
  Bottom Layer w0.203: v2(39.75,34.28) 39.75,33.26 39.5,33.01 38.61,33.01 38.35,32.76 38.35,30.22 v2(37.85,29.71)
$1N4831: length 4.3
  Top Layer w0.203: U2.26 40.5,32.77 C11.1
$1N5092: length 5.8
  Top Layer w0.203: C15.1 C14.2 40.57,47.02 U2.55
$1N7337: length 5.7
  Top Layer w0.203: 42.54,35.8 42.54,34.03 43.31,33.26 44.49,33.26 45.59,32.16 C12.2
$1N7431: length 4.3
  Top Layer w0.203: U2.28 41.5,33.67 42.64,32.54 C88.1
$1N25134: length 4
  Top Layer w0.203: R40.1 48.45,42.59 47.11,42.59 46.66,42.14 45.3,42.14
$1N55226: length 2.5
  Top Layer w0.203: LED8.1 50.89,43.52 R40.2
$2N5729: length 6.1
  Top Layer w0.203: 76.37,35.84 78.61,33.6 78.61,32.59 77.24,31.22
$2N5800: length 3.3
  Top Layer w0.203: R35.1 67.9,25.56
$2N5854: length 9.8
  Top Layer w0.203: R36.1 76.84,9.77 81.03,13.96 81.03,16.05 U4.37
$2N6886: length 5.5
  Top Layer w0.203: U4.38 81.86,15.92 81.86,11.98
$2N6891: length 4.6
  Top Layer w0.203: U4.39 83.63,14.85 LED2.2
$2N6901: length 3.3
  Top Layer w0.203: LED3.2 83.22,16.68 U4.41
$2N6908: length 2
  Top Layer w0.203: 82.99,10.86 84.39,9.46 R37.2
$2N6911: length 2
  Top Layer w0.203: LED2.1 86.21,11.2 R38.2
$2N6918: length 2.2
  Top Layer w0.203: LED3.1 87.1,14.11 R39.2
$2N26546: length 11.9
  Top Layer w0.203: C60.2 63.68,12.06 X2.1 66.85,13.75 U4.13
$2N26553: length 18
  Top Layer w0.203: U4.12 67.62,15.23 62.61,15.23 60.71,17.13 59.44,17.13 58.17,15.87 58.17,15.1 X2.3 57.81,12.69 C59.2
$2N31920: length 3.5
  Top Layer w0.203: U4.49 86.14,19.42 87.57,19.42
$3N912: length 2.2
  Top Layer w0.203: U7.4 73.79,64.96 C61.2
$3N1315: length 2.3
  Top Layer w0.203: C67.2 49.94,64.98 U8.4
$3N1681: length 4.8
  Top Layer w0.203: U5.5 59.94,73.71 C74.2
$3N1685: length 2.4
  Top Layer w0.203: C74.1 59.24,75.11 U5.3
$3N2115: length 2.1
  Top Layer w0.203: C82.2 83.72,72.22 U6.4
$3N3985: length 2.4
  Top Layer w0.203: R41.1 80.26,65.05 LED4.1
$3N4296: length 2.4
  Top Layer w0.203: R44.1 70.9,73.65 LED7.2
$3N4331: length 2.4
  Top Layer w0.203: R43.2 87.6,71.19 LED6.1
$3N4363: length 2.9
  Top Layer w0.203: R42.1 58.8,64.57 LED5.1

## Copper pours and planes (outline as drawn; the poured copper is in the pictures)
GND on Top Layer: 19.18,52.44 22.48,52.44 22.48,47.87 19.18,47.87
GND on Top Layer: -4.19,84.19 103.25,84.19 103.25,50.03 -4.19,50.03
GND on Top Layer: -3.81,83.56 27.94,83.56 27.94,-5.34 -3.81,-5.34
GND on Top Layer: 54.61,51.81 59.31,51.81 59.31,45.71 54.61,45.71
GND on Top Layer: 81.12,52.78 85.98,52.78 85.98,44.95 81.12,44.95
GND on Top Layer: 30.11,46.85 102.87,46.85 102.87,-1.28 30.11,-1.28
GND on Bottom Layer: -2.79,81.4 101.98,81.4 101.98,-2.04 -2.79,-2.04

Small or netless copper shapes (teardrops, artwork), in the pictures only: 2 on Top Layer

## Text on the board
Top Silkscreen Layer: BIASV | CBIAS | IN8N | IN8P | IN7N | IN7P | IN6N | IN6P | IN5N | IN5P | IN4N | IN4P | IN3N | IN3P | IN2N | IN2P | IN1N | IN1P | SRB1 | 功能测试 | SRB2 | VDD | VSS | -5V | DVDD | 3V3 | AVDD | 2V5 | AVSS | -2V5 | GPIO2 | GPIO3 | GPIO1 | 噪声 | VREFP | GND | 3V3/DVDD | U2TX | U2RX | 单点接入测试 | 复位按键 | 脑坤接口小板板 | 芯片控制与SPI数据传输 | RESET | PWDN | START | CLK | MISO | MOSI | SCLK | CS | DRDY | RST | TCK | TMS | SWD烧录口 | TX | RX | U3RX | U3TX | 蓝牙
